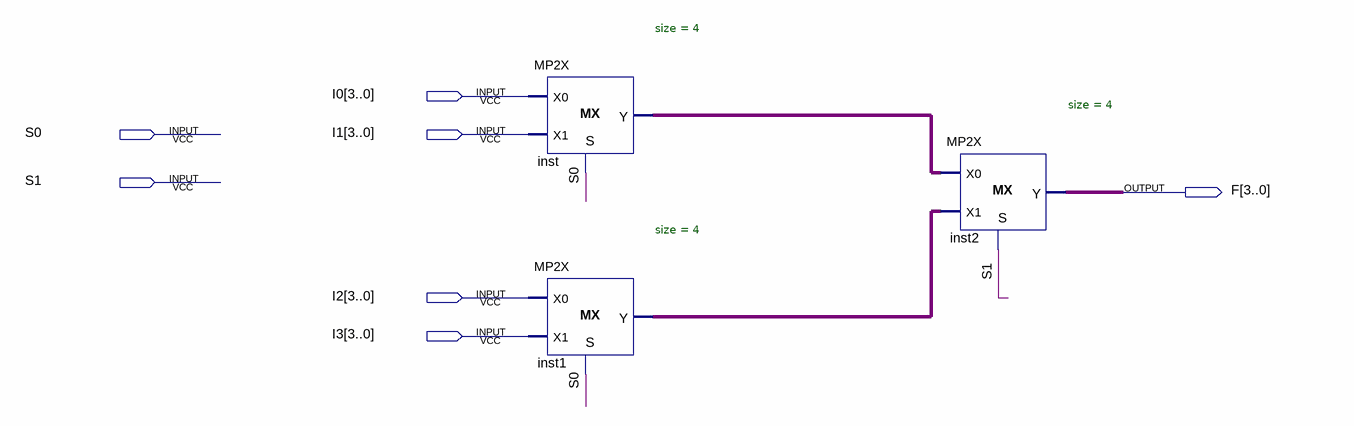
[diagram p0: schematic sheet]
// Quartus schematic MX4_4.bdf as structural Verilog: 3 symbols, 7 pins
module MX4_4 (
  input  [3:0] I0,
  input  S0,
  input  [3:0] I1,
  input  S1,
  input  [3:0] I2,
  input  [3:0] I3,
  output [3:0] F
);

  wire [3:0] inst1_y, inst_y;

  MP2X #(.size(4)) inst (.S(S0), .X0(I0), .X1(I1), .Y(inst_y));
  MP2X #(.size(4)) inst1 (.S(S0), .X0(I2), .X1(I3), .Y(inst1_y));
  MP2X #(.size(4)) inst2 (.S(S1), .X0(inst_y), .X1(inst1_y), .Y(F));
endmodule
